# Altium schematic sheet STM_AK.SchDoc
size A4
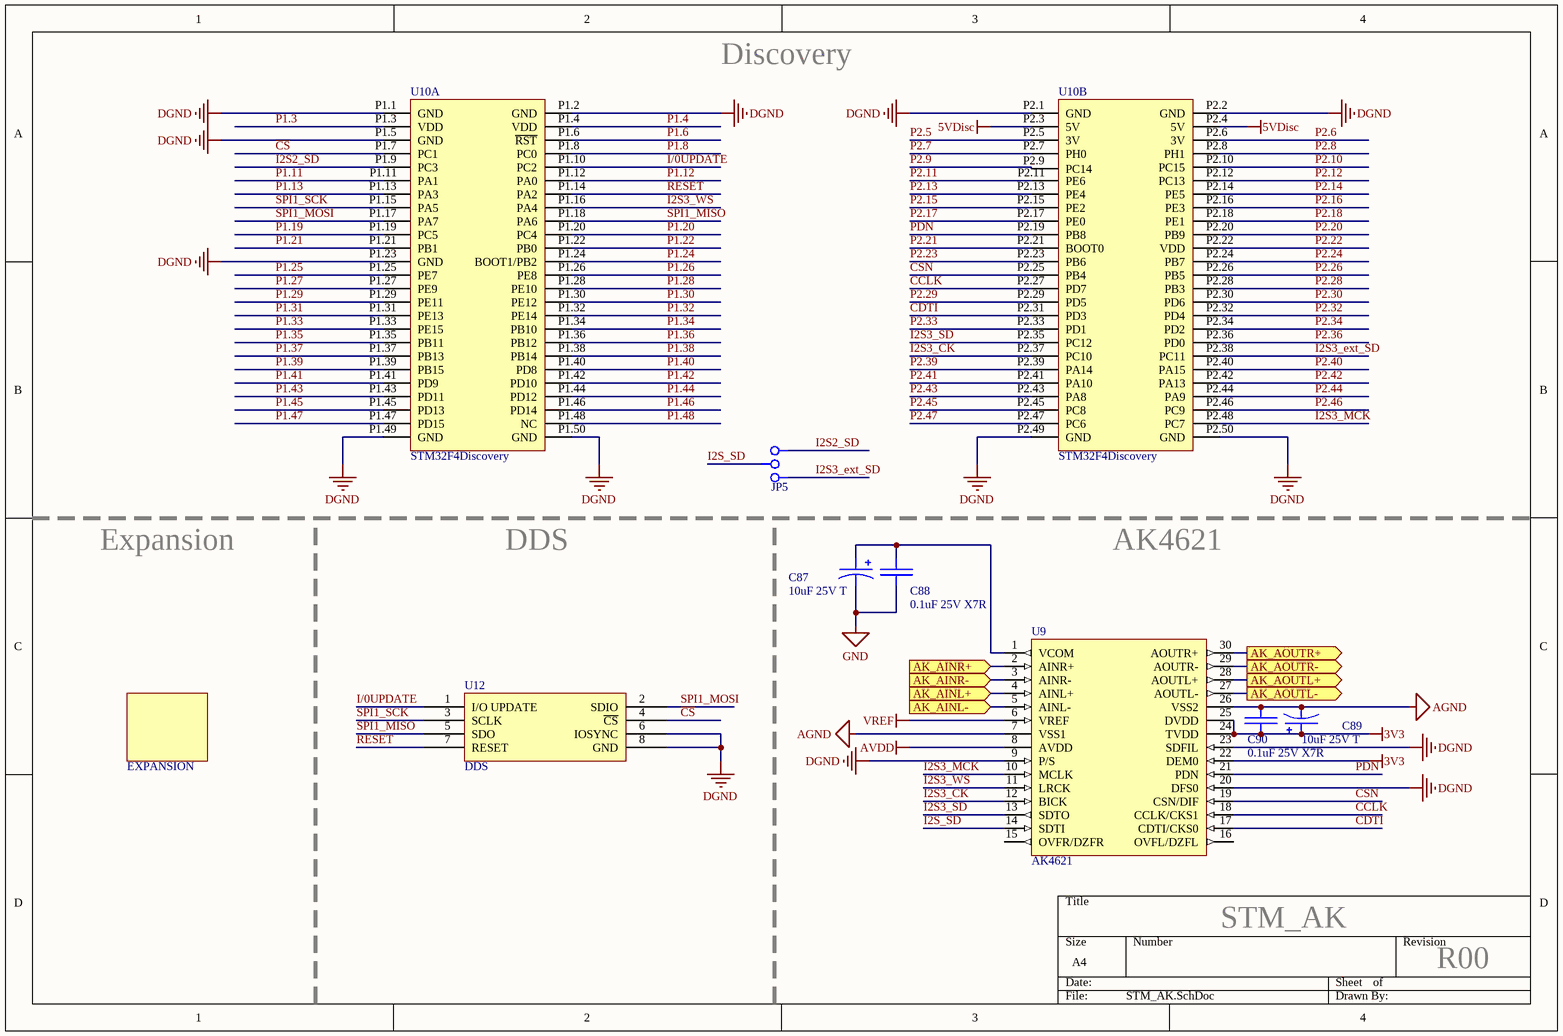
[diagram p0: STM_AK.SchDoc]

## Parts
?  EXPANSION  [EXPANSION]
C87  10uF 25V T  [TANT]
C88  0.1uF 25V X7R  [C_0805]
C89  10uF 25V T  [TANT]
C90  0.1uF 25V X7R  [C_0805]
JP5  Jumper 3x1  [Conn_3_1]  (value not drawn)
U9  AK4621  [AK4621]
U10  STM32F4Discovery  [STM32F4DISCOVERY]  (parts A,B of 2)
U12  DDS  [Conn_2x4]

## Ports
AK_AINL+ (in), AK_AINL- (in), AK_AINR+ (in), AK_AINR- (in), AK_AOUTL+ (out), AK_AOUTL- (out), AK_AOUTR+ (out), AK_AOUTR- (out)

## Nets
3V3: C89.1 C90.1 U9.22(DEM0) U9.24(TVDD) U9.25(DVDD)
5VDisc: U10.P2.3(5V) U10.P2.4(5V)
AGND: C89.2 C90.2 U9.7(VSS1) U9.26(VSS2)
AVDD: U9.8(AVDD)
DGND: U9.9(P/S) U9.20(DFS0) U9.23(SDFIL) U10.P1.1(GND) U10.P1.2(GND) U10.P1.5(GND) U10.P1.23(GND) U10.P1.49(GND) U10.P1.50(GND) U10.P2.1(GND) U10.P2.2(GND) U10.P2.49(GND) U10.P2.50(GND) U12.6(IOSYNC) U12.8(GND)
GND: C87.2 C88.2
VREF: U9.6(VREF)
AK_AINL+: U9.4(AINL+) ; port AK_AINL+
AK_AINL-: U9.5(AINL-) ; port AK_AINL-
AK_AINR+: U9.2(AINR+) ; port AK_AINR+
AK_AINR-: U9.3(AINR-) ; port AK_AINR-
AK_AOUTL+: U9.28(AOUTL+) ; port AK_AOUTL+
AK_AOUTL-: U9.27(AOUTL-) ; port AK_AOUTL-
AK_AOUTR+: U9.30(AOUTR+) ; port AK_AOUTR+
AK_AOUTR-: U9.29(AOUTR-) ; port AK_AOUTR-
~{CS}: U10.P1.7(PC1) U12.4(~{CS})
CCLK: U9.18(CCLK/CKS1) U10.P2.27(PD7)
CDTI: U9.17(CDTI/CKS0) U10.P2.31(PD3)
CSN: U9.19(CSN/DIF) U10.P2.25(PB4)
I2S2_SD: JP5.1 U10.P1.9(PC3)
I2S3_CK: U9.12(BICK) U10.P2.37(PC10)
I2S3_ext_SD: JP5.3 U10.P2.38(PC11)
I2S3_MCK: U9.10(MCLK) U10.P2.48(PC7)
I2S3_SD: U9.13(SDTO) U10.P2.35(PC12)
I2S3_WS: U9.11(LRCK) U10.P1.16(PA4)
I2S_SD: JP5.2 U9.14(SDTI)
I/0UPDATE: U10.P1.10(PC2) U12.1(I/O_UPDATE)
P1.3: U10.P1.3(VDD)
P1.4: U10.P1.4(VDD)
P1.6: U10.P1.6(~{RST})
P1.8: U10.P1.8(PC0)
P1.11: U10.P1.11(PA1)
P1.12: U10.P1.12(PA0)
P1.13: U10.P1.13(PA3)
P1.19: U10.P1.19(PC5)
P1.20: U10.P1.20(PC4)
P1.21: U10.P1.21(PB1)
P1.22: U10.P1.22(PB0)
P1.24: U10.P1.24(BOOT1/PB2)
P1.25: U10.P1.25(PE7)
P1.26: U10.P1.26(PE8)
P1.27: U10.P1.27(PE9)
P1.28: U10.P1.28(PE10)
P1.29: U10.P1.29(PE11)
P1.30: U10.P1.30(PE12)
P1.31: U10.P1.31(PE13)
P1.32: U10.P1.32(PE14)
P1.33: U10.P1.33(PE15)
P1.34: U10.P1.34(PB10)
P1.35: U10.P1.35(PB11)
P1.36: U10.P1.36(PB12)
P1.37: U10.P1.37(PB13)
P1.38: U10.P1.38(PB14)
P1.39: U10.P1.39(PB15)
P1.40: U10.P1.40(PD8)
P1.41: U10.P1.41(PD9)
P1.42: U10.P1.42(PD10)
P1.43: U10.P1.43(PD11)
P1.44: U10.P1.44(PD12)
P1.45: U10.P1.45(PD13)
P1.46: U10.P1.46(PD14)
P1.47: U10.P1.47(PD15)
P1.48: U10.P1.48(NC)
P2.5: U10.P2.5(3V)
P2.6: U10.P2.6(3V)
P2.7: U10.P2.7(PH0)
P2.8: U10.P2.8(PH1)
P2.9: U10.P2.9(PC14)
P2.10: U10.P2.10(PC15)
P2.11: U10.P2.11(PE6)
P2.12: U10.P2.12(PC13)
P2.13: U10.P2.13(PE4)
P2.14: U10.P2.14(PE5)
P2.15: U10.P2.15(PE2)
P2.16: U10.P2.16(PE3)
P2.17: U10.P2.17(PE0)
P2.18: U10.P2.18(PE1)
P2.20: U10.P2.20(PB9)
P2.21: U10.P2.21(BOOT0)
P2.22: U10.P2.22(VDD)
P2.23: U10.P2.23(PB6)
P2.24: U10.P2.24(PB7)
P2.26: U10.P2.26(PB5)
P2.28: U10.P2.28(PB3)
P2.29: U10.P2.29(PD5)
P2.30: U10.P2.30(PD6)
P2.32: U10.P2.32(PD4)
P2.33: U10.P2.33(PD1)
P2.34: U10.P2.34(PD2)
P2.36: U10.P2.36(PD0)
P2.39: U10.P2.39(PA14)
P2.40: U10.P2.40(PA15)
P2.41: U10.P2.41(PA10)
P2.42: U10.P2.42(PA13)
P2.43: U10.P2.43(PA8)
P2.44: U10.P2.44(PA9)
P2.45: U10.P2.45(PC8)
P2.46: U10.P2.46(PC9)
P2.47: U10.P2.47(PC6)
PDN: U9.21(PDN) U10.P2.19(PB8)
RESET: U10.P1.14(PA2) U12.7(RESET)
SPI1_MISO: U10.P1.18(PA6) U12.5(SDO)
SPI1_MOSI: U10.P1.17(PA7) U12.2(SDIO)
SPI1_SCK: U10.P1.15(PA5) U12.3(SCLK)
NetC87_1: C87.1 C88.1 U9.1(VCOM)

Not connected (* = marked no-connect by the designer): U9 15(OVFR/DZFR) 16(OVFL/DZFL)

## Notes on the sheet
- Discovery
- Expansion
- DDS
- AK4621
- STM_AK
- R00

## Library data of the parts
C87 C89 = CapaPol: Capacitor polarizado; Encapsulado: TH; Cod. Proveedor: -; Proveedor: -
C88 C90 = Capacitor: Capacitor de placas paralelas; Cod. Proveedor: CA3289100; Encapsulado: 0603; Proveedor: Elemon
JP5 = Jumper 3x1: Cod. Proveedor: CO4921360; Proveedor: Elemon
U9 = AK4621: CODEC 24 bits 192kHz; Cod. Proveedor: Ya esta; Encapsulado: SMD; Proveedor: Ya esta
U10 = STM32F4Discovery: Cod. Proveedor: MC6350305; Proveedor: Elemon
U12 = DDS_Pablo